# EAGLE design Kippstufe astabil (EAGLE 6.2)
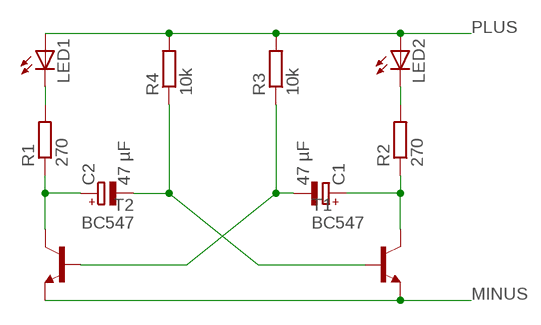
[diagram p0: schematic, sheet 1]

## Parts
C1  47 µF  CPOL-EUB45181B  [B45181B]
C2  47 µF  CPOL-EUB45181B  [B45181B]
LED1  LED5MM  [LED5MM]
LED2  LED5MM  [LED5MM]
R1  270  R-EU_0204/7  [0204/7]
R2  270  R-EU_0204/7  [0204/7]
R3  10k  R-EU_0204/7  [0204/7]
R4  10k  R-EU_0204/7  [0204/7]
T1  BC547  [TO92]
T2  BC547  [TO92]

## Nets
MINUS: T1.1(E) T2.1(E)
N$2: C2.+ R1.1 T2.3(C)
N$3: C1.+ R2.1 T1.3(C)
N$4: C1.- R3.1 T2.2(B)
N$5: C2.- R4.1 T1.2(B)
N$7: LED2.K(C) R2.2
N$8: LED1.K(C) R1.2
PLUS: LED1.A LED2.A R3.2 R4.2

## Library data of the parts
C1 C2 = resistor:CPOL-EU: POLARIZED CAPACITOR, European symbol
LED1 LED2 = led:LED: LED OSRAM: - CHIPLED LG R971, LG N971, LY N971, LG Q971, LY Q971, LO R971, LY R971 LH N974, LH R974 LS Q976, LO Q976, LY Q976 LO Q996 - Hyper CHIPLED LW Q18S LB Q993, LB Q99A, LB R99A - SideLED LS A670, LO A670, LY A670, LG A670, LP A670 LB A673, LV A673, LT A673, LW A673 LH A674 LY A675 LS A676, LA A676, LO A676, LY A676, LW A676 LS A679, LY A679, LG A679 - Hyper Micro SIDELED® LS Y876, LA Y876, LO Y876, LY Y876 LT Y87S - SmartLED LW L88C, LW L88S LB L89C, LB L89S, LG L890 LS L89K, LO L89K, LY L89K LS L896, LA L896, LO L896, LY L896 - TOPLED LS T670, LO T670, LY T670, LG T670, LP T670 LSG T670, LSP T670, LSY T670, LOP T670, LYG T670 LG T671, LOG T671, LSG T671 LB T673, LV T673, LT T673, LW T673 LH T674 LS T676, LA T676, LO T676, LY T676, LB T676, LH T676, LSB T676, LW T676 LB T67C, LV T67C, LT T67C, LS T67K, LO T67K, LY T67K, LW E67C LS E67B, LA E67B, LO E67B, LY E67B, LB E67C, LV E67C, LT E67C LW T67C LS T679, LY T679, LG T679 LS T770, LO T770, LY T770, LG T770, LP T770 LB T773, LV T773, LT T773, LW T773 LH T774 LS E675, LA E675, LY E675, LS T675 LS T776, LA T776, LO T776, LY T776, LB T776 LHGB T686 LT T68C, LB T68C - Hyper Mini TOPLED® LB M676 - Mini TOPLED Santana® LG M470 LS M47K, LO M47K, LY M47K Source: http://www.osram.convergy.de LUXEON: - LUMILED® LXK2-PW12-R00, LXK2-PW12-S00, LXK2-PW14-U00, LXK2-PW14-V00 LXK2-PM12-R00, LXK2-PM12-S00, LXK2-PM14-U00 LXK2-PE12-Q00, LXK2-PE12-R00, LXK2-PE12-S00, LXK2-PE14-T00, LXK2-PE14-U00 LXK2-PB12-K00, LXK2-PB12-L00, LXK2-PB12-M00, LXK2-PB14-N00, LXK2-PB14-P00, LXK2-PB14-Q00 LXK2-PR12-L00, LXK2-PR12-M00, LXK2-PR14-Q00, LXK2-PR14-R00 LXK2-PD12-Q00, LXK2-PD12-R00, LXK2-PD12-S00 LXK2-PH12-R00, LXK2-PH12-S00 LXK2-PL12-P00, LXK2-PL12-Q00, LXK2-PL12-R00 Source: www.luxeon.com KINGBRIGHT: KA-3528ASYC Source: www.kingbright.com
R1-R4 = resistor:R-EU_: RESISTOR, European symbol
T1 T2 = transistor:BC547: NPN TRANSISTOR

## Board
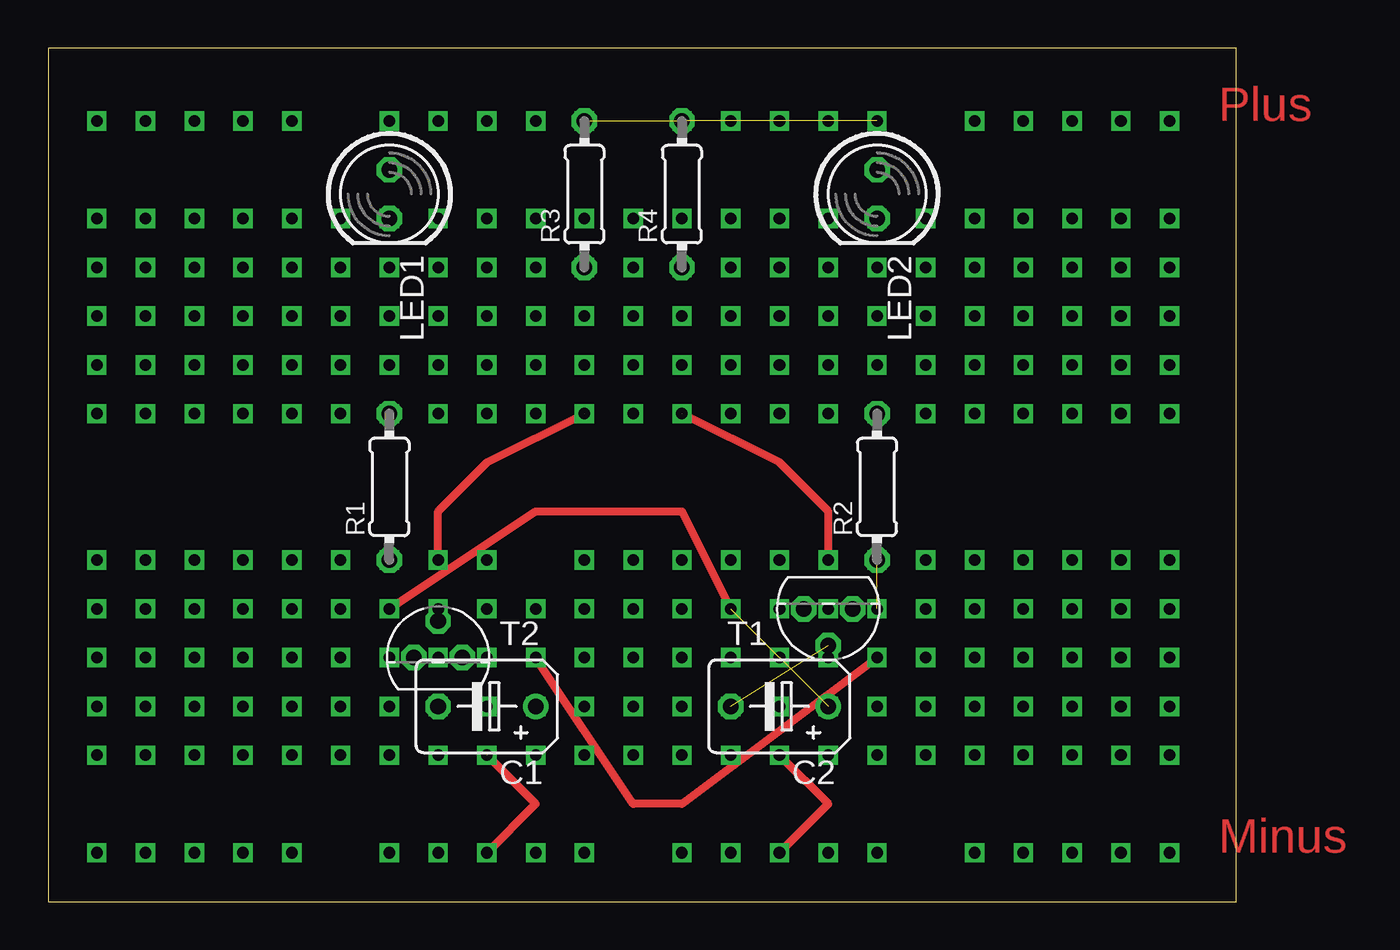
[diagram p1: board, top side]
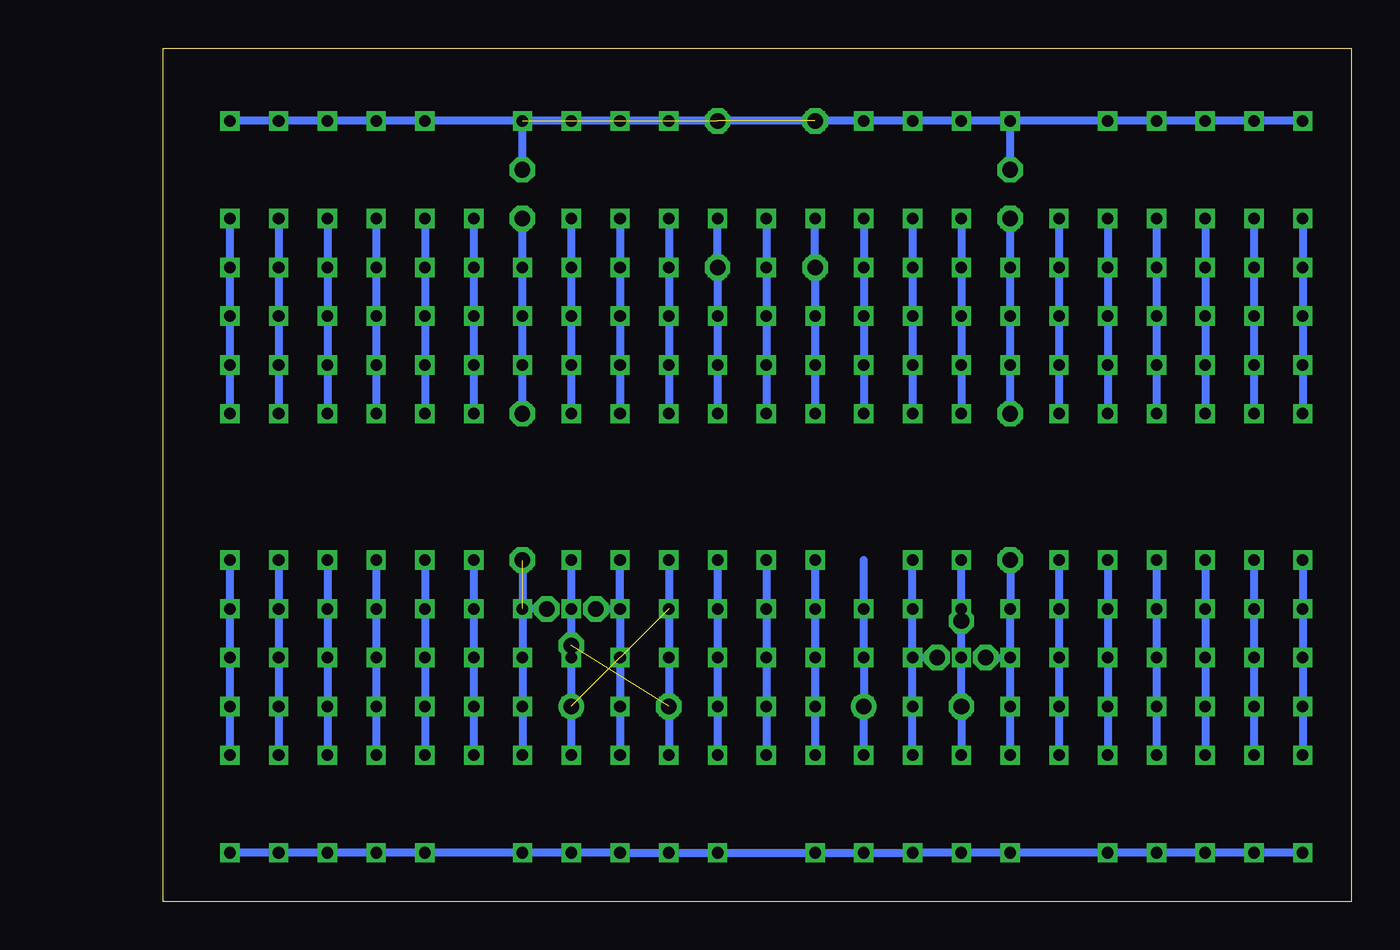
[diagram p2: board, bottom side, seen from below]

Size 61.9 x 44.44 mm. Coordinates in mm from the lower left corner, seen from the top.
Outline: 0,0 61.9,0 61.9,44.44 0,44.44 0,0
Copper layers (1*16): Top 0.035mm / dielectric 1.5mm / Bottom 0.035mm
Design rules: minimum track width 10mil, minimum drill 24mil, track to track 8mil, track to pad 8mil, pad to pad 8mil, via to via 8mil, smd to smd 8mil, copper to edge 40mil, drill to drill 8mil, minimum pad ring 10mil, minimum via ring 8mil, stop-mask expansion 4mil, vias tented up to drill 0mil, thermal gap 10mil

### Footprints (pad centres in the part's own frame; a part is rotated, then mirrored left to right if it is on the bottom)
B45181B = drill 0.813: + -2.54,0 | drill 0.813 octagon: - 2.54,0
LED5MM = drill 0.813 octagon: A -1.27,0; K 1.27,0
0204/7 = drill 0.813 octagon: 1 -3.81,0; 2 3.81,0
TO92 = drill 0.813 octagon: 1 1.27,0; 2 0,1.905; 3 -1.27,0

### Placement (x,y rotation side)
C1  22.86,10.16 180 top
C2  38.1,10.16 180 top
LED1  17.78,36.83 270 top
LED2  43.18,36.83 270 top
R1  17.78,21.59 90 top
R2  43.18,21.59 90 top
R3  27.94,36.83 90 top
R4  33.02,36.83 90 top
T1  40.64,15.24 180 top
T2  20.32,12.7 0 top

### Tracks (layer width: path | path; a pad name or v marks a point on that pad's centre or on a via)
MINUS  (via drill 0.6)  (1 unrouted)
  Top 0.406: v38.1,7.62 40.64,5.08 v38.1,2.54 | v22.86,2.54 25.4,5.08 22.86,7.62
  Bottom 0.406: T2.1 22.86,12.7 | 22.86,12.7 22.86,17.78 | 22.86,7.62 22.86,12.7 | T1.1 38.1,15.24 | 38.1,15.24 38.1,17.78 | 38.1,15.24 v38.1,7.62 | 58.42,2.54 v38.1,2.54 v22.86,2.54 2.54,2.54
N$2  (via drill 0.6)  (1 unrouted)
  Top 0.406: v17.78,15.24 25.4,20.32 33.02,20.32 35.56,15.24
  Bottom 0.406: R1.1 v17.78,15.24 17.78,12.7 | 17.78,7.62 17.78,12.7 | T2.3 17.78,12.7
N$3  (via drill 0.6)  (1 unrouted)
  Top 0.406: v43.18,12.7 33.02,5.08 30.48,5.08 v25.4,12.7
  Bottom 0.406: T1.3 43.18,15.24 v43.18,12.7 | 25.4,17.78 v25.4,12.7 C1.+ 25.4,7.62
N$4  (via drill 0.6)  (1 unrouted)
  Top 0.406: v20.32,17.78 20.32,20.32 22.86,22.86 27.94,25.4
  Bottom 0.406: 27.94,25.4 R3.1 27.94,35.56 | v20.32,17.78 T2.2 C1.- v20.32,7.62
  other vias: 20.32,10.16
N$5  (via drill 0.6)  (2 unrouted)
  Top 0.406: v40.64,17.78 40.64,20.32 38.1,22.86 33.02,25.4
  Bottom 0.406: 33.02,35.56 R4.1 33.02,25.4 | v40.64,17.78 T1.2
N$6  (via drill 0.6)
  other vias: 5.08,40.64
N$7
  Bottom 0.406: R2.2 LED2.K
N$8
  Bottom 0.406: R1.2 LED1.K
N$9  (via drill 0.6)
  other vias: 7.62,40.64
N$10  (via drill 0.6)
  other vias: 10.16,40.64
N$11  (via drill 0.6)
  other vias: 12.7,40.64
N$13  (via drill 0.6)
  other vias: 20.32,40.64
N$14  (via drill 0.6)
  other vias: 22.86,40.64
N$15  (via drill 0.6)
  other vias: 25.4,40.64
N$16  (via drill 0.6)
  other vias: 27.94,40.64
N$17  (via drill 0.6)
  other vias: 33.02,40.64
N$18  (via drill 0.6)
  other vias: 35.56,40.64
N$19  (via drill 0.6)
  other vias: 38.1,40.64
N$20  (via drill 0.6)
  other vias: 40.64,40.64
N$22  (via drill 0.6)
  other vias: 48.26,40.64
N$23  (via drill 0.6)
  other vias: 50.8,40.64
N$24  (via drill 0.6)
  other vias: 53.34,40.64
N$25  (via drill 0.6)
  other vias: 55.88,40.64
N$27  (via drill 0.6)
  Bottom 0.406: v2.54,35.56 v2.54,25.4
N$28  (via drill 0.6)
  other vias: 2.54,33.02
N$29  (via drill 0.6)
  other vias: 2.54,30.48
N$30  (via drill 0.6)
  other vias: 2.54,27.94
N$32  (via drill 0.6)
  Bottom 0.406: v5.08,35.56 v5.08,25.4
N$33  (via drill 0.6)
  other vias: 5.08,33.02
N$34  (via drill 0.6)
  other vias: 5.08,30.48
N$35  (via drill 0.6)
  other vias: 5.08,27.94
N$37  (via drill 0.6)
  Bottom 0.406: v7.62,35.56 v7.62,25.4
N$38  (via drill 0.6)
  other vias: 7.62,33.02
N$39  (via drill 0.6)
  other vias: 7.62,30.48
N$40  (via drill 0.6)
  other vias: 7.62,27.94
N$42  (via drill 0.6)
  Bottom 0.406: v10.16,35.56 v10.16,25.4
N$43  (via drill 0.6)
  other vias: 10.16,33.02
N$44  (via drill 0.6)
  other vias: 10.16,30.48
N$45  (via drill 0.6)
  other vias: 10.16,27.94
N$47  (via drill 0.6)
  Bottom 0.406: v12.7,35.56 v12.7,25.4
N$48  (via drill 0.6)
  other vias: 12.7,33.02
N$49  (via drill 0.6)
  other vias: 12.7,30.48
N$50  (via drill 0.6)
  other vias: 12.7,27.94
N$52  (via drill 0.6)
  other vias: 17.78,35.56
N$53  (via drill 0.6)
  other vias: 17.78,33.02
N$54  (via drill 0.6)
  other vias: 17.78,30.48
N$55  (via drill 0.6)
  other vias: 17.78,27.94
N$56  (via drill 0.6)
  other vias: 17.78,25.4
N$57  (via drill 0.6)
  Bottom 0.406: v15.24,35.56 v15.24,25.4
N$58  (via drill 0.6)
  other vias: 15.24,33.02
N$59  (via drill 0.6)
  other vias: 15.24,30.48
N$60  (via drill 0.6)
  other vias: 15.24,27.94
N$62  (via drill 0.6)
  Bottom 0.406: v20.32,35.56 v20.32,25.4
N$63  (via drill 0.6)
  other vias: 20.32,33.02
N$64  (via drill 0.6)
  other vias: 20.32,30.48
N$65  (via drill 0.6)
  other vias: 20.32,27.94
N$67  (via drill 0.6)
  Bottom 0.406: v22.86,35.56 v22.86,25.4
N$68  (via drill 0.6)
  other vias: 22.86,33.02
N$69  (via drill 0.6)
  other vias: 22.86,30.48
N$70  (via drill 0.6)
  other vias: 22.86,27.94
N$72  (via drill 0.6)
  Bottom 0.406: v25.4,35.56 v25.4,25.4
N$73  (via drill 0.6)
  other vias: 25.4,33.02
N$74  (via drill 0.6)
  other vias: 25.4,30.48
N$75  (via drill 0.6)
  other vias: 25.4,27.94
N$77  (via drill 0.6)
  other vias: 27.94,35.56
N$78  (via drill 0.6)
  other vias: 27.94,33.02
N$79  (via drill 0.6)
  other vias: 27.94,30.48
N$80  (via drill 0.6)
  other vias: 27.94,27.94
N$81  (via drill 0.6)
  other vias: 27.94,25.4
N$82  (via drill 0.6)
  Bottom 0.406: v30.48,35.56 v30.48,25.4
N$83  (via drill 0.6)
  other vias: 30.48,33.02
N$84  (via drill 0.6)
  other vias: 30.48,30.48
N$85  (via drill 0.6)
  other vias: 30.48,27.94
N$87  (via drill 0.6)
  other vias: 33.02,35.56
N$88  (via drill 0.6)
  other vias: 33.02,33.02
N$89  (via drill 0.6)
  other vias: 33.02,30.48
N$90  (via drill 0.6)
  other vias: 33.02,27.94
N$91  (via drill 0.6)
  other vias: 33.02,25.4
N$92  (via drill 0.6)
  Bottom 0.406: v35.56,35.56 v35.56,25.4
N$93  (via drill 0.6)
  other vias: 35.56,33.02
N$94  (via drill 0.6)
  other vias: 35.56,30.48
N$95  (via drill 0.6)
  other vias: 35.56,27.94
N$97  (via drill 0.6)
  Bottom 0.406: v38.1,35.56 v38.1,25.4
N$98  (via drill 0.6)
  other vias: 38.1,33.02
N$99  (via drill 0.6)
  other vias: 38.1,30.48
N$100  (via drill 0.6)
  other vias: 38.1,27.94
N$102  (via drill 0.6)
  Bottom 0.406: v40.64,35.56 v40.64,25.4
N$103  (via drill 0.6)
  other vias: 40.64,33.02
N$104  (via drill 0.6)
  other vias: 40.64,30.48
N$105  (via drill 0.6)
  other vias: 40.64,27.94
N$107  (via drill 0.6)
  other vias: 43.18,25.4
N$114  (via drill 0.6)
  Bottom 0.406: v58.42,35.56 v58.42,25.4
N$115  (via drill 0.6)
  Bottom 0.406: v55.88,35.56 v55.88,25.4
N$116  (via drill 0.6)
  Bottom 0.406: v53.34,35.56 v53.34,25.4
N$117  (via drill 0.6)
  Bottom 0.406: v50.8,35.56 v50.8,25.4
N$118  (via drill 0.6)
  Bottom 0.406: v48.26,35.56 v48.26,25.4
N$119  (via drill 0.6)
  Bottom 0.406: v45.72,35.56 v45.72,25.4
N$120  (via drill 0.6)
  other vias: 43.18,35.56
N$121  (via drill 0.6)
  other vias: 43.18,33.02
N$122  (via drill 0.6)
  other vias: 45.72,33.02
N$123  (via drill 0.6)
  other vias: 48.26,33.02
N$124  (via drill 0.6)
  other vias: 50.8,33.02
N$125  (via drill 0.6)
  other vias: 53.34,33.02
N$126  (via drill 0.6)
  other vias: 55.88,33.02
N$127  (via drill 0.6)
  other vias: 58.42,33.02
N$128  (via drill 0.6)
  other vias: 43.18,30.48
N$129  (via drill 0.6)
  other vias: 45.72,30.48
N$130  (via drill 0.6)
  other vias: 48.26,30.48
N$131  (via drill 0.6)
  other vias: 50.8,30.48
N$132  (via drill 0.6)
  other vias: 53.34,30.48
N$133  (via drill 0.6)
  other vias: 55.88,30.48
N$134  (via drill 0.6)
  other vias: 58.42,30.48
N$135  (via drill 0.6)
  other vias: 43.18,27.94
N$136  (via drill 0.6)
  other vias: 45.72,27.94
N$137  (via drill 0.6)
  other vias: 48.26,27.94
N$138  (via drill 0.6)
  other vias: 50.8,27.94
N$139  (via drill 0.6)
  other vias: 53.34,27.94
N$140  (via drill 0.6)
  other vias: 55.88,27.94
N$141  (via drill 0.6)
  other vias: 58.42,27.94
N$142  (via drill 0.6)
  Bottom 0.406: v2.54,17.78 v2.54,7.62
N$143  (via drill 0.6)
  Bottom 0.406: v5.08,17.78 v5.08,7.62
N$144  (via drill 0.6)
  Bottom 0.406: v7.62,17.78 v7.62,7.62
N$145  (via drill 0.6)
  Bottom 0.406: v10.16,17.78 v10.16,7.62
N$146  (via drill 0.6)
  Bottom 0.406: v12.7,17.78 v12.7,7.62
N$147  (via drill 0.6)
  Bottom 0.406: v15.24,17.78 v15.24,7.62
N$148  (via drill 0.6)
  other vias: 17.78,17.78
N$150  (via drill 0.6)
  other vias: 22.86,17.78
N$152  (via drill 0.6)
  Bottom 0.406: v27.94,17.78 v27.94,7.62
N$153  (via drill 0.6)
  Bottom 0.406: v30.48,17.78 v30.48,7.62
N$154  (via drill 0.6)
  Bottom 0.406: v33.02,17.78 v33.02,7.62
N$155  (via drill 0.6)
  Bottom 0.406: v35.56,17.78 v35.56,7.62
N$156  (via drill 0.6)
  other vias: 38.1,17.78
N$157  (via drill 0.6)
  other vias: 40.64,17.78
N$158  (via drill 0.6)
  Bottom 0.406: v43.18,17.78 v43.18,7.62
N$159  (via drill 0.6)
  Bottom 0.406: v45.72,17.78 v45.72,7.62
N$160  (via drill 0.6)
  Bottom 0.406: v48.26,17.78 v48.26,7.62
N$161  (via drill 0.6)
  Bottom 0.406: v50.8,17.78 v50.8,7.62
N$162  (via drill 0.6)
  Bottom 0.406: v53.34,17.78 v53.34,7.62
N$163  (via drill 0.6)
  Bottom 0.406: v55.88,17.78 v55.88,7.62
N$164  (via drill 0.6)
  Bottom 0.406: v58.42,17.78 v58.42,7.62
N$165  (via drill 0.6)
  other vias: 2.54,15.24
N$166  (via drill 0.6)
  other vias: 5.08,15.24
N$167  (via drill 0.6)
  other vias: 7.62,15.24
N$168  (via drill 0.6)
  other vias: 10.16,15.24
N$169  (via drill 0.6)
  other vias: 12.7,15.24
N$170  (via drill 0.6)
  other vias: 15.24,15.24
N$171  (via drill 0.6)
  other vias: 17.78,15.24
N$172  (via drill 0.6)
  other vias: 22.86,15.24
N$173  (via drill 0.6)
  Bottom 0.406: v20.32,15.24 v20.32,17.78
N$174  (via drill 0.6)
  other vias: 25.4,15.24
N$175  (via drill 0.6)
  other vias: 27.94,15.24
N$176  (via drill 0.6)
  other vias: 30.48,15.24
N$177  (via drill 0.6)
  other vias: 33.02,15.24
N$178  (via drill 0.6)
  other vias: 35.56,15.24
N$179  (via drill 0.6)
  other vias: 38.1,15.24
N$180  (via drill 0.6)
  other vias: 40.64,15.24
N$181  (via drill 0.6)
  other vias: 43.18,15.24
N$182  (via drill 0.6)
  other vias: 45.72,15.24
N$183  (via drill 0.6)
  other vias: 48.26,15.24
N$184  (via drill 0.6)
  other vias: 50.8,15.24
N$185  (via drill 0.6)
  other vias: 53.34,15.24
N$186  (via drill 0.6)
  other vias: 55.88,15.24
N$187  (via drill 0.6)
  other vias: 58.42,15.24
N$188  (via drill 0.6)
  other vias: 2.54,12.7
N$189  (via drill 0.6)
  other vias: 5.08,12.7
N$190  (via drill 0.6)
  other vias: 7.62,12.7
N$191  (via drill 0.6)
  other vias: 10.16,12.7
N$192  (via drill 0.6)
  other vias: 15.24,12.7
N$193  (via drill 0.6)
  other vias: 12.7,12.7
N$194  (via drill 0.6)
  other vias: 17.78,12.7
N$195  (via drill 0.6)
  other vias: 20.32,12.7
N$196  (via drill 0.6)
  other vias: 22.86,12.7
N$197  (via drill 0.6)
  other vias: 25.4,12.7
N$198  (via drill 0.6)
  other vias: 27.94,12.7
N$199  (via drill 0.6)
  other vias: 30.48,12.7
N$200  (via drill 0.6)
  other vias: 33.02,12.7
N$201  (via drill 0.6)
  other vias: 35.56,12.7
N$202  (via drill 0.6)
  other vias: 38.1,12.7
N$203  (via drill 0.6)
  Bottom 0.406: v40.64,12.7 v40.64,7.62
N$204  (via drill 0.6)
  other vias: 43.18,12.7
N$205  (via drill 0.6)
  other vias: 45.72,12.7
N$206  (via drill 0.6)
  other vias: 48.26,12.7
N$207  (via drill 0.6)
  other vias: 50.8,12.7
N$208  (via drill 0.6)
  other vias: 53.34,12.7
N$209  (via drill 0.6)
  other vias: 55.88,12.7
N$210  (via drill 0.6)
  other vias: 58.42,12.7
N$211  (via drill 0.6)
  other vias: 2.54,10.16
N$212  (via drill 0.6)
  other vias: 5.08,10.16
N$213  (via drill 0.6)
  other vias: 7.62,10.16
N$214  (via drill 0.6)
  other vias: 10.16,10.16
N$215  (via drill 0.6)
  other vias: 15.24,10.16
N$216  (via drill 0.6)
  other vias: 12.7,10.16
N$217  (via drill 0.6)
  other vias: 17.78,10.16
N$218  (via drill 0.6)
  other vias: 20.32,10.16
N$219  (via drill 0.6)
  other vias: 22.86,10.16
N$220  (via drill 0.6)
  other vias: 25.4,10.16
N$221  (via drill 0.6)
  other vias: 27.94,10.16
N$222  (via drill 0.6)
  other vias: 30.48,10.16
N$223  (via drill 0.6)
  other vias: 33.02,10.16
N$224  (via drill 0.6)
  other vias: 35.56,10.16
N$225  (via drill 0.6)
  other vias: 38.1,10.16
N$226  (via drill 0.6)
  other vias: 40.64,10.16
N$227  (via drill 0.6)
  other vias: 43.18,10.16
N$228  (via drill 0.6)
  other vias: 45.72,10.16
N$229  (via drill 0.6)
  other vias: 48.26,10.16
N$230  (via drill 0.6)
  other vias: 50.8,10.16
N$231  (via drill 0.6)
  other vias: 53.34,10.16
N$232  (via drill 0.6)
  other vias: 55.88,10.16
N$233  (via drill 0.6)
  other vias: 58.42,10.16
N$240  (via drill 0.6)
  other vias: 17.78,7.62
N$242  (via drill 0.6)
  other vias: 22.86,7.62
N$243  (via drill 0.6)
  other vias: 25.4,7.62
N$248  (via drill 0.6)
  other vias: 38.1,7.62
N$257  (via drill 0.6)
  other vias: 2.54,2.54
N$258  (via drill 0.6)
  other vias: 5.08,2.54
N$259  (via drill 0.6)
  other vias: 7.62,2.54
N$260  (via drill 0.6)
  other vias: 10.16,2.54
N$261  (via drill 0.6)
  other vias: 12.7,2.54
N$262  (via drill 0.6)
  other vias: 17.78,2.54
N$263  (via drill 0.6)
  other vias: 20.32,2.54
N$264  (via drill 0.6)
  other vias: 22.86,2.54
N$265  (via drill 0.6)
  other vias: 25.4,2.54
N$266  (via drill 0.6)
  other vias: 27.94,2.54
N$267  (via drill 0.6)
  other vias: 33.02,2.54
N$268  (via drill 0.6)
  other vias: 35.56,2.54
N$269  (via drill 0.6)
  other vias: 38.1,2.54
N$270  (via drill 0.6)
  other vias: 40.64,2.54
N$271  (via drill 0.6)
  other vias: 43.18,2.54
N$272  (via drill 0.6)
  other vias: 48.26,2.54
N$273  (via drill 0.6)
  other vias: 50.8,2.54
N$274  (via drill 0.6)
  other vias: 53.34,2.54
N$275  (via drill 0.6)
  other vias: 55.88,2.54
N$276  (via drill 0.6)
  other vias: 58.42,2.54
PLUS  (via drill 0.6)  (2 unrouted)
  Bottom 0.406: LED1.A v17.78,40.64 | LED2.A v43.18,40.64 | v2.54,40.64 v17.78,40.64 | v17.78,40.64 v43.18,40.64 | v43.18,40.64 v58.42,40.64

### Text on the board
Top: Plus | Minus